# EAGLE design 228_3axis (EAGLE 9.6.2)
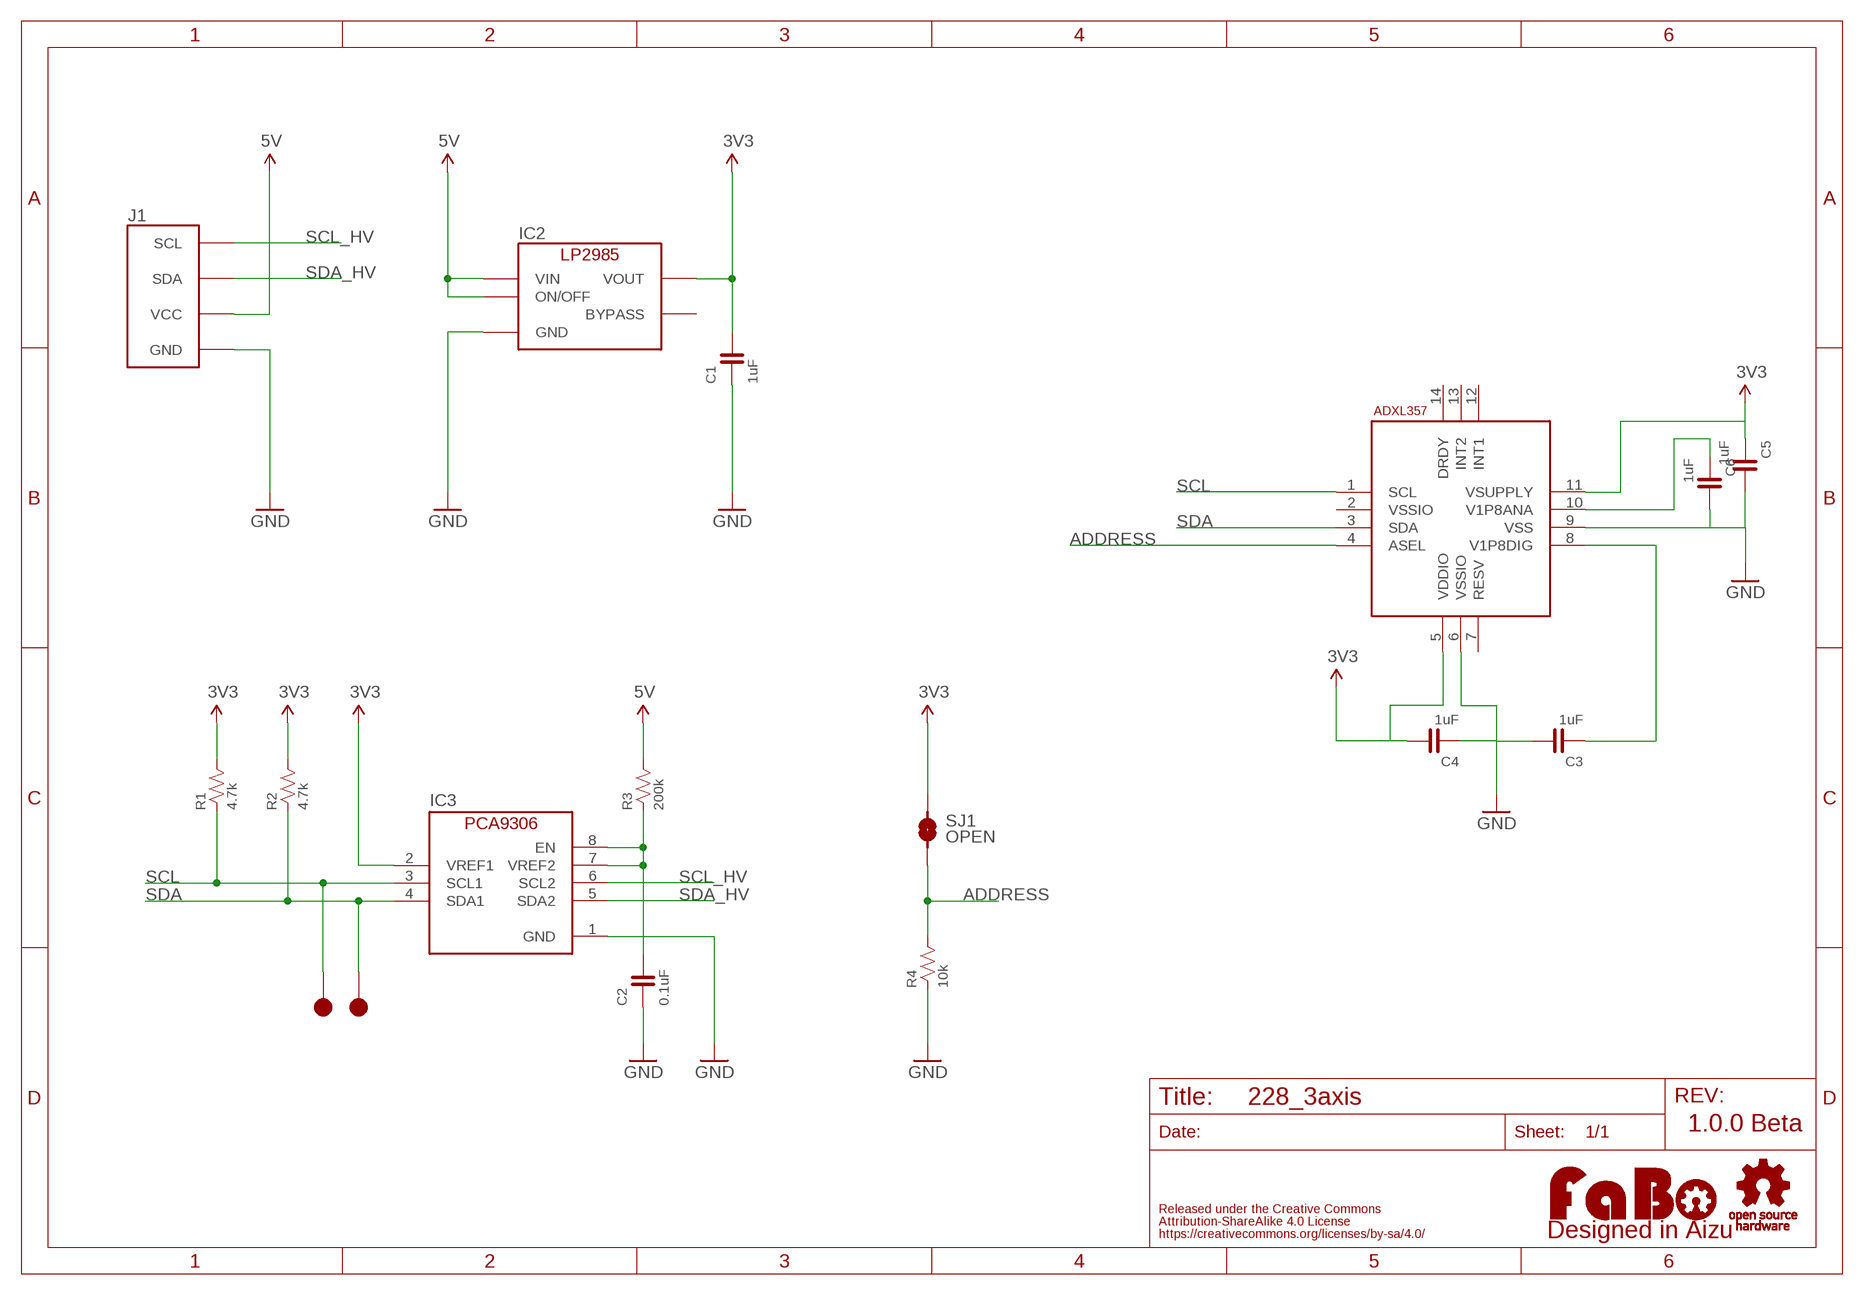
[diagram p0: schematic, sheet 1]

## Parts
A1  AD-ADXL356  [ANALOGDEVICES-ADXL356]
C1  1uF  CAPACITOR-0603  [0603]
C2  0.1uF  CAPACITOR-0603  [0603]
C3  1uF  CAPACITOR-0603  [0603]
C4  1uF  CAPACITOR-0603  [0603]
C5  1uF  CAPACITOR-0603  [0603]
C6  1uF  CAPACITOR-0603  [0603]
IC2  LP2985-33DBV  [SOT-23-5]
IC3  PCA9306GM  [XQFN8]
J1  FABO_BRICK_I2C  [FABO_BRICK_I2C]
LOGO1  LOGO_FABO-M  [LOGO_FABO_M]
R1  4.7k  RESISTOR-0603  [0603]
R2  4.7k  RESISTOR-0603  [0603]
R3  200k  RESISTOR-0603  [0603]
R4  10k  RESISTOR-0603  [0603]
SJ1  OPEN  SMD-JUMPER-2  [SMD-JUMPER-2]
TP1  TP-15  [TP-15]
TP2  TP-15  [TP-15]
U$2  LOGO_OSHW-M_BOTTOM  [LOGO_OSHW_M_BOTTOM]

## Nets
3V3: A1.5(VDDIO) A1.11(VSUPPLY) C1.2 C4.2 C5.1 IC2.5(VOUT) IC3.2(VREF1) R1.2 R2.2 SJ1.1
5V: IC2.1(VIN) IC2.3(ON/OFF) J1.VCC R3.2
ADDRESS: A1.4(ASEL) R4.2 SJ1.2
GND: A1.6(VSSIO) A1.9(VSS) C1.1 C2.1 C3.2 C4.1 C5.2 C6.2 IC2.2(GND) IC3.1(GND) J1.GND R4.1
N$1: C2.2 IC3.7(VREF2) IC3.8(EN) R3.1
N$2: A1.10(V1P8ANA) C6.1
N$5: A1.8(V1P8DIG) C3.1
SCL: A1.1(SCL) IC3.3(SCL1) R1.1 TP2.1
SCL_HV: IC3.6(SCL2) J1.SCL
SDA: A1.3(SDA) IC3.4(SDA1) R2.1 TP1.1
SDA_HV: IC3.5(SDA2) J1.SDA
Unconnected: A1.2(VSSIO) A1.7(RESV) A1.12(INT1) A1.13(INT2) A1.14(DRDY) IC2.4(BYPASS)

## Notes on the sheet
- 1.0.0 Beta

## Library data of the parts
A1 = FaBo-Mems:AD-ADXL356
C1-C6 = FaBo-Capacitor:CAPACITOR: CAPACITOR
IC2 = FaBo-Supply:LP2985: LP2985
IC3 = FaBo-LevelTranslator:PCA9306
J1 = FaBo-Template:FABO_BRICK_I2C: FaBo Brick I2C
LOGO1 = component:LOGO_FABO
R1-R4 = FaBo-Resistors:RESISTOR: RESISTOR
SJ1 = FaBo-etc:SMD-JUMPER-2
TP1 TP2 = FaBo-Supply:TP
U$2 = FaBo-etc:LOGO_OSHW

## Board
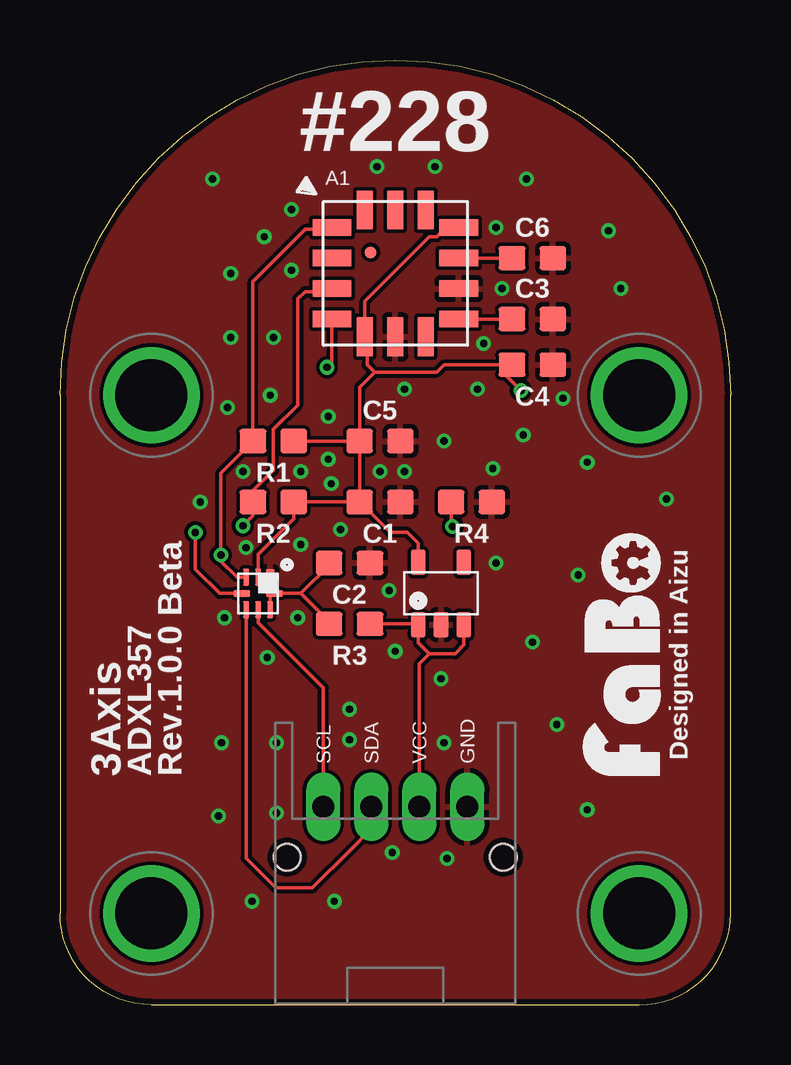
[diagram p1: board, top side]
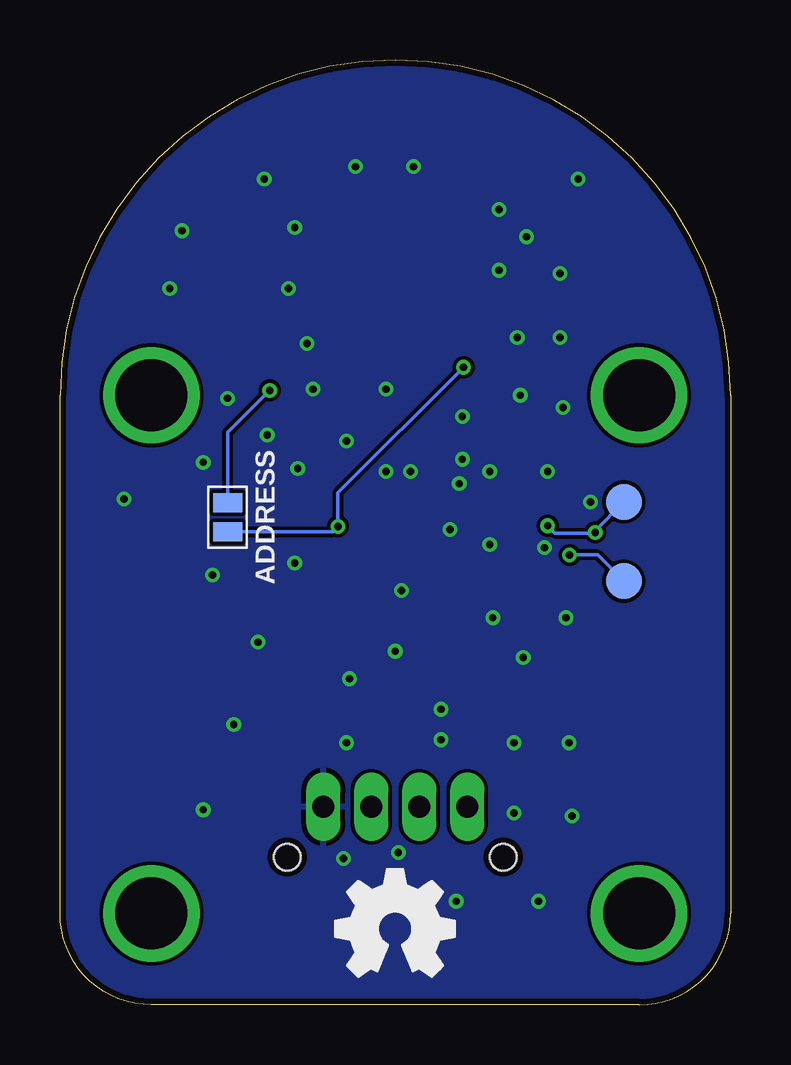
[diagram p2: board, bottom side, seen from below]

Size 27.94 x 39.37 mm. Coordinates in mm from the lower left corner, seen from the top.
Copper layers (1*16): Top 0.035mm / dielectric 1.6mm / Bottom 0.035mm
Design rules "PCBway": minimum track width 6mil, minimum drill 12mil, track to track 6mil, track to pad 6mil, pad to pad 6mil, via to via 6mil, smd to smd 6mil, copper to edge 10mil, drill to drill 10mil, minimum pad ring 10mil, minimum via ring 6mil, stop-mask expansion 2mil, vias tented up to drill 100mil, thermal gap 8mil

### Footprints (pad centres in the part's own frame; a part is rotated, then mirrored left to right if it is on the bottom)
ANALOGDEVICES-ADXL356 = smd 1.614 x 0.68: 1 -2.64,1.905; 2 -2.64,0.635; 3 -2.64,-0.635; 4 -2.64,-1.905; 8 2.64,-1.905; 9 2.64,-0.635; 10 2.64,0.635; 11 2.64,1.905 | smd 0.68 x 1.614: 5 -1.27,-2.64; 6 0,-2.64; 7 1.27,-2.64; 12 1.27,2.64; 13 0,2.64; 14 -1.27,2.64 | smd 0.5 x 0.5: P$15 -1.03,0.87
0603 = smd 1.1 x 1: 1 -0.85,0; 2 0.85,0
SOT-23-5 = smd 0.6 x 1.05: 1 -0.95,-1.3; 2 0,-1.3; 3 0.95,-1.3; 4 0.95,1.3; 5 -0.95,1.3
XQFN8 = smd 0.7 x 0.35: 1 -0.675,0.5 | smd 0.7 x 0.25: 2 -0.675,0; 3 -0.675,-0.5; 5 0.675,-0.5; 6 0.675,0; 7 0.675,0.5 | smd 0.25 x 0.7: 4 0,-0.675; 8 0,0.675
FABO_BRICK_I2C = drill 0.9 pad 1.422 long: GND 3,-10.795; SCL -3,-10.795; SDA -1,-10.795; VCC 1,-10.795 | drill 3 pad 3.81: P$1 -10.16,6.35; P$2 10.16,6.35; P$3 -10.16,-15.24; P$4 10.16,-15.24 | hole 1.1: -4.5,-12.895; 4.5,-12.895
SMD-JUMPER-2 = smd 0.8 x 1.2: 1 -0.6,0; 2 0.6,0
TP-15 = smd 1.5 x 1.5: 1 0,0

### Placement (x,y rotation side)
A1  13.97,30.48 0 top
C1  13.34,20.95 180 top
C2  12.06,18.41 180 top
C3  19.68,28.57 0 top
C4  19.68,26.67 180 top
C5  13.34,23.5 0 top
C6  19.68,31.11 0 top
IC2  15.88,17.14 0 top
IC3  8.26,17.14 270 top
J1  13.97,19.05 0 top
LOGO1  25.4,14.61 90 top
R1  8.89,23.5 0 top
R2  8.89,20.95 0 top
R3  12.06,15.88 0 top
R4  17.14,20.95 180 top
SJ1  20.95,20.32 270 bottom
TP1  4.45,20.95 0 bottom
TP2  4.45,17.65 0 bottom
U$2  13.97,3.17 0 top

### Tracks (layer width: path | path; a pad name or v marks a point on that pad's centre or on a via)
3V3  (via drill 0.3)
  Top 0.152: 18.59,26.67 16,26.67 15.7,26.36 13.11,26.36 | 18.59,26.67 C4.2 | 13.11,26.36 12.8,26.67 12.8,27.74 A1.5 12.7,29.31 15.39,32 15.7,32 16.08,32.38 A1.11 | v19.2,25.6 18.59,26.21 18.59,26.67 | IC3.2 8.26,18.77 9.74,20.26 R2.2 C1.2 | IC2.5 14.93,19.24 14.48,19.68 13.76,19.68 C1.2 | C1.2 C5.1 | C5.1 12.48,25.74 13.11,26.36 | R1.2 C5.1
  Bottom 0.152: SJ1.1 20.95,23.85 v19.2,25.6
5V
  Top 0.152: 15.39,14.63 16.46,14.63 16.82,15 IC2.3 | 15.39,14.63 14.94,15.09 IC2.1 14.89,15.88 R3.2 | J1.VCC 14.97,14.21 15.39,14.63
ADDRESS  (via drill 0.3)
  Top 0.152: A1.4 11.33,26.77 v11.12,26.57 | R4.2 16.3,20 v16.36,19.94
  Bottom 0.152: SJ1.2 16.58,19.72 v16.36,19.94 16.36,21.34 v11.12,26.57
GND  (via drill 0.3)
  other vias: 7.75,19.05 7.62,22.23 10.03,22.23 11.18,22.73 11.3,21.72 11.18,24.51 8.76,25.4 6.99,24.89 5.84,20.95 10.03,19.18 11.68,19.81 13.34,22.23 14.35,22.23 14.35,25.65 17.4,25.65 17.65,27.56 18.41,29.84 18.16,32.38 23.37,29.84 22.86,32.26 19.3,23.75 20.95,25.27 21.97,22.61 21.59,17.91 18.16,18.41 18.03,22.35 16,23.5 13.72,17.27 13.97,14.73 15.88,13.59 12.06,12.32 9.91,16.13 8.64,14.48 6.86,16.13 6.73,10.92 9.02,10.92 12.06,11.05 9.02,8 6.6,7.87 13.84,6.35 16.13,6.1 11.43,4.32 8,4.32 16,10.92 21.97,8.13 19.68,15.11 9.65,30.61 8.89,27.81 7.11,27.81 7.11,30.48 8.51,32 9.65,33.15 13.21,34.92 15.62,34.92 19.43,34.42 6.35,34.42 25.27,21.08 20.7,11.68
  pour Bottom: 0,0 27.94,0 27.94,39.37 0,39.37
  pour Top: 0,0 27.94,0 27.94,39.37 0,39.37
N$1
  Top 0.152: 10.03,17.14 IC3.8 8.76,17.14 IC3.7 | 10.03,17.14 11.21,15.96 R3.1 | C2.2 11.21,18.33 10.03,17.14
N$2
  Top 0.152: A1.10 C6.1
N$5
  Top 0.152: A1.8 C3.1
SCL  (via drill 0.3)
  Top 0.152: IC3.3 7.38,17.82 6.71,18.49 v6.71,18.75 6.71,22.16 R1.1 8.04,30.14 10.21,32.31 11.25,32.31 A1.1
  Bottom 0.152: TP2.1 5.54,18.75 v6.71,18.75
SCL_HV
  Top 0.152: IC3.6 8.26,15.93 10.97,13.21 J1.SCL
SDA  (via drill 0.3)
  Top 0.152: v5.64,19.68 5.64,18.16 6.66,17.14 IC3.4 | v7.62,19.96 8.04,20.38 R2.1 8.04,21.43 8.89,22.28 8.89,23.98 9.91,24.99 9.91,29.41 10.21,29.72 11.2,29.72 A1.3
  Bottom 0.152: v7.62,19.96 7.32,19.66 5.66,19.66 v5.64,19.68 5.64,19.76 TP1.1
SDA_HV
  Top 0.152: IC3.5 7.75,6.11 8.99,4.88 10.52,4.88 12.09,6.45 12.95,7.32 12.97,7.33 J1.SDA

### Text on the board
tPlace: #228 | Designed in Aizu | 3Axis | ADXL357 | Rev.1.0.0 Beta
bPlace: ADDRESS